# Altium schematic sheet Encoder Fin - System.SchDoc
size B
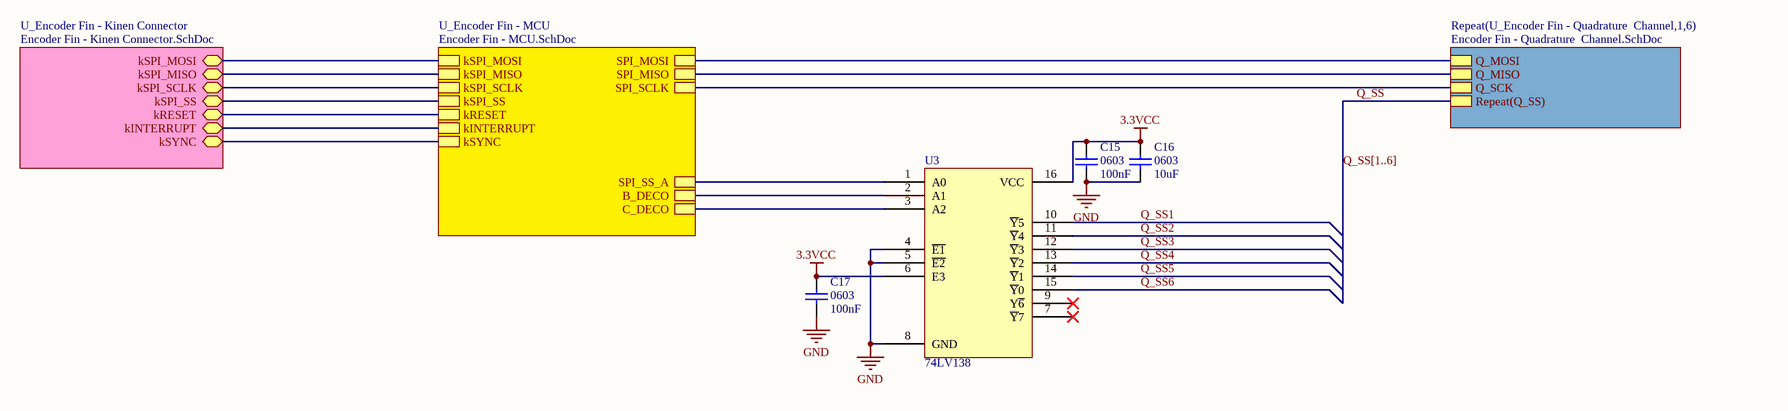
[diagram p0: Encoder Fin - System.SchDoc]

## Parts
C15  0603  value 100nF  [1608[0603]]
C16  0603  value 10uF  [1608[0603]]
C17  0603  value 100nF  [1608[0603]]
U3  74LV138  [TSOP65P640X120-16N-74IC]

## Sub-sheets
Repeat(U_Encoder Fin - Quadrature  Channel,1,6) = Encoder Fin - Quadrature  Channel.SchDoc: Q_MOSI, Q_MISO, Q_SCK, Repeat(Q_SS)
U_Encoder Fin - Kinen Connector = Encoder Fin - Kinen Connector.SchDoc: kSPI_MOSI, kSPI_MISO, kSPI_SCLK, kSPI_SS, kRESET, kINTERRUPT, kSYNC
U_Encoder Fin - MCU = Encoder Fin - MCU.SchDoc: kSPI_MOSI, kSPI_MISO, kSPI_SCLK, kSPI_SS, kRESET, kINTERRUPT, kSYNC, SPI_SCLK, SPI_MISO, SPI_MOSI, B_DECO, C_DECO, SPI_SS_A

## Nets
3.3VCC: C15.2 C16.2 C17.2 U3.6(E3) U3.16(VCC)
GND: C15.1 C16.1 C17.1 U3.4(~{E1}) U3.5(~{E2}) U3.8(GND)
Q_SS: sheet Repeat(U_Encoder Fin - Quadrature  Channel,1,6)/Repeat(Q_SS)
Q_SS1: U3.10(~{Y}5)
Q_SS2: U3.11(~{Y}4)
Q_SS3: U3.12(~{Y}3)
Q_SS4: U3.13(~{Y}2)
Q_SS5: U3.14(~{Y}1)
Q_SS6: U3.15(~{Y}0)
NetU3_1: U3.1(A0) ; sheet U_Encoder Fin - MCU/SPI_SS_A
NetU3_2: U3.2(A1) ; sheet U_Encoder Fin - MCU/B_DECO
NetU3_3: U3.3(A2) ; sheet U_Encoder Fin - MCU/C_DECO
(unnamed): sheet Repeat(U_Encoder Fin - Quadrature  Channel,1,6)/Q_MOSI, sheet U_Encoder Fin - MCU/SPI_MOSI
(unnamed): sheet Repeat(U_Encoder Fin - Quadrature  Channel,1,6)/Q_MISO, sheet U_Encoder Fin - MCU/SPI_MISO
(unnamed): sheet Repeat(U_Encoder Fin - Quadrature  Channel,1,6)/Q_SCK, sheet U_Encoder Fin - MCU/SPI_SCLK
(unnamed): sheet U_Encoder Fin - MCU/kSPI_MOSI, sheet U_Encoder Fin - Kinen Connector/kSPI_MOSI
(unnamed): sheet U_Encoder Fin - MCU/kSPI_MISO, sheet U_Encoder Fin - Kinen Connector/kSPI_MISO
(unnamed): sheet U_Encoder Fin - MCU/kSPI_SCLK, sheet U_Encoder Fin - Kinen Connector/kSPI_SCLK
(unnamed): sheet U_Encoder Fin - MCU/kSPI_SS, sheet U_Encoder Fin - Kinen Connector/kSPI_SS
(unnamed): sheet U_Encoder Fin - MCU/kRESET, sheet U_Encoder Fin - Kinen Connector/kRESET
(unnamed): sheet U_Encoder Fin - MCU/kINTERRUPT, sheet U_Encoder Fin - Kinen Connector/kINTERRUPT
(unnamed): sheet U_Encoder Fin - MCU/kSYNC, sheet U_Encoder Fin - Kinen Connector/kSYNC

Not connected (* = marked no-connect by the designer): U3 7(~{Y}7)* 9(Y~{6})*

## Buses and harness runs
bus Q_SS[1..6]

## Library data of the parts
C15-C17 = Cap Semi: Capacitor (Semiconductor SIM Model); Published: 8-Jun-2000; LatestRevisionDate: 29-May-2009; LatestRevisionNote: IPC-7351 Footprint Added.; PackageReference: C1206; Publisher: Altium Limited; PackageDescription: Chip Capacitor
U3 = 74LV138 - 3 to 8 Decoder NXP 3.3v/5v